# EAGLE schematic Spuds-V0.6 (EAGLE 6.4)
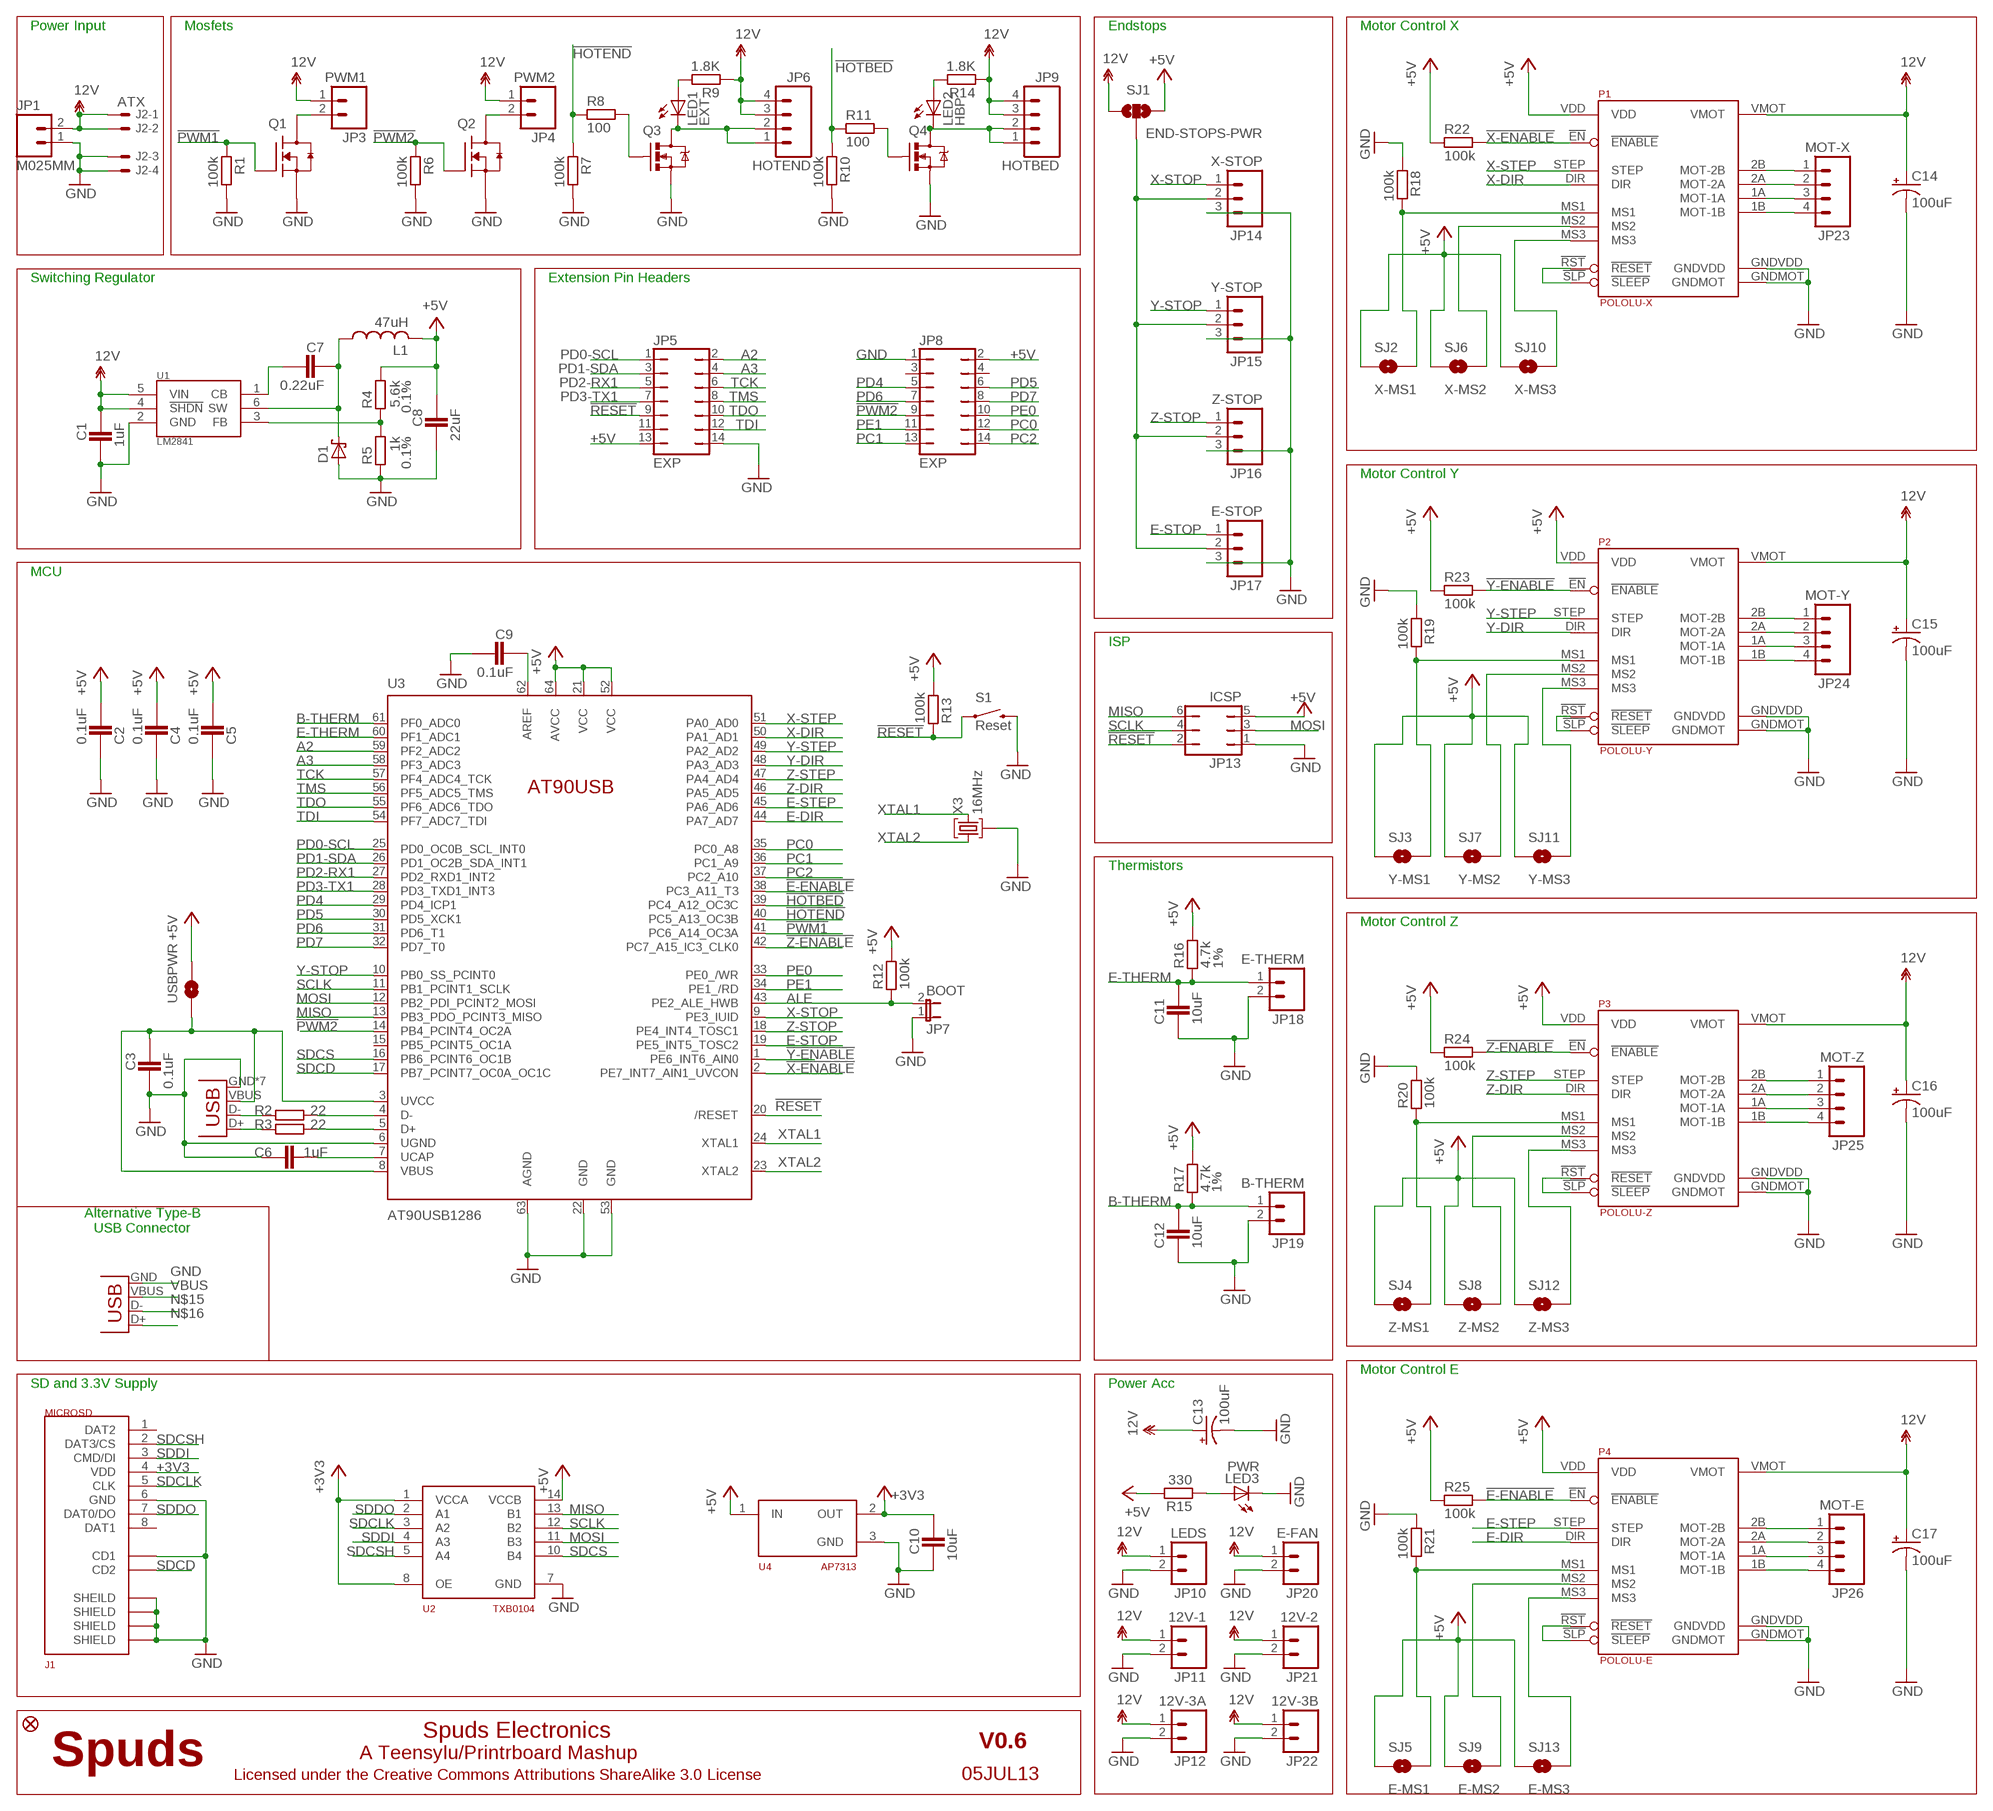
[diagram p0: schematic, sheet 1]

## Parts
C1  1uF  CAPACITOR_0805  [CAPC2012X145AN]
C2  0.1uF  CAPACITOR_0805  [CAPC2012X145AN]
C3  0.1uF  CAPACITOR_0805  [CAPC2012X145AN]
C4  0.1uF  CAPACITOR_0805  [CAPC2012X145AN]
C5  0.1uF  CAPACITOR_0805  [CAPC2012X145AN]
C6  1uF  CAPACITOR_0805  [CAPC2012X145AN]
C7  0.22uF  CAPACITOR_0805  [CAPC2012X145AN]
C8  22uF  CAPACITOR_0805  [CAPC2012X145AN]
C9  0.1uF  CAPACITOR_0805  [CAPC2012X145AN]
C10  10uF  CAPACITOR_0805  [CAPC2012X145AN]
C11  10uF  CAPACITOR_0805  [CAPC2012X145AN]
C12  10uF  CAPACITOR_0805  [CAPC2012X145AN]
C13  100uF  CPOL-USD  [PANASONIC_D]
C14  100uF  CPOL-USD  [PANASONIC_D]
C15  100uF  CPOL-USD  [PANASONIC_D]
C16  100uF  CPOL-USD  [PANASONIC_D]
C17  100uF  CPOL-USD  [PANASONIC_D]
D1  SCH-DIODESMA  [SMA]
J1  MICROSD  [AMPHENOL-MICROSD]
J2  ATX  5566-4  [5566-4]
JP1  M025MM  [SCREWTERMINAL-5MM-2]
JP2  FIDUCIAL1X2.5  [FIDUCIAL-1X2.5]
JP3  PWM1  M02PTH  [1X02]
JP4  PWM2  M02PTH  [1X02]
JP5  EXP  JP7Q  [JP7Q]
JP6  HOTEND  M04POLAR  [MOLEX-1X4]
JP7  BOOT  JUMPER-2PTH  [1X02]
JP8  EXP  JP7Q  [JP7Q]
JP9  HOTBED  M04POLAR  [MOLEX-1X4]
JP10  LEDS  M02PTH  [1X02]
JP11  12V-1  M02PTH  [1X02]
JP12  12V-3A  M02PTH  [1X02]
JP13  ICSP  JP3Q  [JP3Q]
JP14  X-STOP  M03POLAR  [MOLEX-1X3]
JP15  Y-STOP  M03POLAR  [MOLEX-1X3]
JP16  Z-STOP  M03POLAR  [MOLEX-1X3]
JP17  E-STOP  M03POLAR  [MOLEX-1X3]
JP18  E-THERM  M02PTH  [1X02]
JP19  B-THERM  M02PTH  [1X02]
JP20  E-FAN  M02PTH  [1X02]
JP21  12V-2  M02PTH  [1X02]
JP22  12V-3B  M02PTH  [1X02]
JP23  MOT-X  M04POLAR  [MOLEX-1X4]
JP24  MOT-Y  M04POLAR  [MOLEX-1X4]
JP25  MOT-Z  M04POLAR  [MOLEX-1X4]
JP26  MOT-E  M04POLAR  [MOLEX-1X4]
L1  47uH  L-US  [SDR1006]
LED1  EXT  LEDCHIP-LED0805  [CHIP-LED0805]
LED2  HBP  LEDCHIP-LED0805  [CHIP-LED0805]
LED3  PWR  LEDCHIP-LED0805  [CHIP-LED0805]
P1  POLOLU-X  POLOLU-ALLEGRO  [POLOLU-ALLEGRO-PTH]
P2  POLOLU-Y  POLOLU-ALLEGRO  [POLOLU-ALLEGRO-PTH]
P3  POLOLU-Z  POLOLU-ALLEGRO  [POLOLU-ALLEGRO-PTH]
P4  POLOLU-E  POLOLU-ALLEGRO  [POLOLU-ALLEGRO-PTH]
Q1  RFP30N06LE  MOSFET-NCH_SOT-23  [SOT95P280X135-3N]
Q2  RFP30N06LE  MOSFET-NCH_SOT-23  [SOT95P280X135-3N]
Q3  RFP30N06LE  MOSFET-NCHANNELPTH2  [TO220V]
Q4  RFP30N06LE  MOSFET-NCHANNELPTH2  [TO220V]
R1  100k  RESISTOR_0805  [RESC2012X70N]
R2  22  RESISTOR_0805  [RESC2012X70N]
R3  22  RESISTOR_0805  [RESC2012X70N]
R4  5.6k  RESISTOR_0805  [RESC2012X70N]
R5  1k  RESISTOR_0805  [RESC2012X70N]
R6  100k  RESISTOR_0805  [RESC2012X70N]
R7  100k  RESISTOR_0805  [RESC2012X70N]
R8  100  RESISTOR_0805  [RESC2012X70N]
R9  1.8K  RESISTOR_0805  [RESC2012X70N]
R10  100k  RESISTOR_0805  [RESC2012X70N]
R11  100  RESISTOR_0805  [RESC2012X70N]
R12  100k  RESISTOR_0805  [RESC2012X70N]
R13  100k  RESISTOR_0805  [RESC2012X70N]
R14  1.8K  RESISTOR_0805  [RESC2012X70N]
R15  330  RESISTOR_0805  [RESC2012X70N]
R16  4.7k  RESISTOR_0805  [RESC2012X70N]
R17  4.7k  RESISTOR_0805  [RESC2012X70N]
R18  100k  RESISTOR_0805  [RESC2012X70N]
R19  100k  RESISTOR_0805  [RESC2012X70N]
R20  100k  RESISTOR_0805  [RESC2012X70N]
R21  100k  RESISTOR_0805  [RESC2012X70N]
R22  100k  RESISTOR_0805  [RESC2012X70N]
R23  100k  RESISTOR_0805  [RESC2012X70N]
R24  100k  RESISTOR_0805  [RESC2012X70N]
R25  100k  RESISTOR_0805  [RESC2012X70N]
S1  Reset  SWITCH-MOMENTARY-2  [TACTILE_SWITCH_TALL]
SJ1  END-STOPS-PWR  SOLDERJUMPER_2WAYPASTE2&3  [SJ_3_PASTE2&3]
SJ2  X-MS1  SOLDERJUMPERNC  [SJ_2S]
SJ3  Y-MS1  SOLDERJUMPERNC  [SJ_2S]
SJ4  Z-MS1  SOLDERJUMPERNC  [SJ_2S]
SJ5  E-MS1  SOLDERJUMPERNC  [SJ_2S]
SJ6  X-MS2  SOLDERJUMPERNC  [SJ_2S]
SJ7  Y-MS2  SOLDERJUMPERNC  [SJ_2S]
SJ8  Z-MS2  SOLDERJUMPERNC  [SJ_2S]
SJ9  E-MS2  SOLDERJUMPERNC  [SJ_2S]
SJ10  X-MS3  SOLDERJUMPERNC  [SJ_2S]
SJ11  Y-MS3  SOLDERJUMPERNC  [SJ_2S]
SJ12  Z-MS3  SOLDERJUMPERNC  [SJ_2S]
SJ13  E-MS3  SOLDERJUMPERNC  [SJ_2S]
U1  LM2841  [TSOT6]
U2  TXB0104  [TSSOP14]
U3  AT90USB1286  AT90USB  [TQFP64-2]
U4  AP7313  [SOT23C]
USBPWR  SOLDERJUMPERNO  [SJ_2S-NO]
X1  USBPTH  [USB-B-PTH]
X2  USB-MICROB  [USB-MICROB]
X3  16MHz  AWSCR-CV  [AWSCR]

## Nets
12V [power]: C1.1 C13.+ C14.+ C15.+ C16.+ C17.+ J2.1 J2.2 JP1.2 JP3.1 JP4.1 JP6.3 JP6.4 JP9.3 JP9.4 JP10.1 JP11.1 JP12.1 JP20.1 JP21.1 JP22.1 P1.VMOT P2.VMOT P3.VMOT P4.VMOT R9.1 R14.1 SJ1.1 U1.4(!SHDN) U1.5(VIN)
!E-ENABLE: P4.!EN(!ENABLE) R25.2 U3.38(PC3_A11_T3)
!HOTBED: R10.1 R11.1 U3.39(PC4_A12_OC3C)
!HOTEND: R7.1 R8.1 U3.40(PC5_A13_OC3B)
!PWM1: Q1.1(G) R1.1 U3.41(PC6_A14_OC3A)
!PWM2: JP8.9 Q2.1(G) R6.1 U3.14(PB4_PCINT4_OC2A)
!RESET: JP5.9 JP13.2 R13.1 S1.A2 U3.20(/RESET)
!X-ENABLE: P1.!EN(!ENABLE) R22.2 U3.2(PE7_INT7_AIN1_UVCON)
!Y-ENABLE: P2.!EN(!ENABLE) R23.2 U3.1(PE6_INT6_AIN0)
!Z-ENABLE: P3.!EN(!ENABLE) R24.2 U3.42(PC7_A15_IC3_CLK0)
+3V3 [power]: C10.1 J1.4(VDD) U2.1(VCCA) U2.8(OE) U4.2(OUT)
+5V [power]: C2.2 C4.2 C5.2 C8.1 JP5.13 JP8.2 JP13.5 L1.P$2 P1.VDD P2.VDD P3.VDD P4.VDD R4.1 R12.2 R13.2 R15.2 R16.2 R17.2 R22.1 R23.1 R24.1 R25.1 SJ1.3 SJ2.1 SJ3.1 SJ4.1 SJ5.1 SJ6.1 SJ7.1 SJ8.1 SJ9.1 SJ10.1 SJ11.1 SJ12.1 SJ13.1 U2.14(VCCB) U3.21(VCC) U3.52(VCC) U3.64(AVCC) U4.1(IN) USBPWR.2
A2: JP5.2 U3.59(PF2_ADC2)
A3: JP5.4 U3.58(PF3_ADC3)
ALE: JP7.2 R12.1 U3.43(PE2_ALE_HWB)
AREF: C9.1 U3.62(AREF)
B-THERM: C12.2 JP19.1 R17.1 U3.61(PF0_ADC0)
E-DIR: P4.DIR U3.44(PA7_AD7)
E-MS1: P4.MS1 R21.2 SJ5.2
E-MS2: P4.MS2 SJ9.2
E-MS3: P4.MS3 SJ13.2
E-RESETSLEEP: P4.!RST(!RESET) P4.!SLP(!SLEEP)
E-STEP: P4.STEP U3.45(PA6_AD6)
E-STOP: JP17.1 U3.19(PE5_INT5_TOSC2)
E-THERM: C11.2 JP18.1 R16.1 U3.60(PF1_ADC1)
END-STOP-PWR [power]: JP14.2 JP15.2 JP16.2 JP17.2 SJ1.2
GND [power]: C1.2 C2.1 C3.2 C4.1 C5.1 C6.1 C8.2 C9.2 C10.2 C11.1 C12.1 C13.- C14.- C15.- C16.- C17.- D1.A J1.6(GND) J1.C1(SHEILD) J1.C2(SHIELD) J1.C3(SHIELD) J1.C4(SHIELD) J1.CD1 J2.3 J2.4 JP1.1 JP5.14 JP7.1 JP8.1 JP10.2 JP11.2 JP12.2 JP13.1 JP14.3 JP15.3 JP16.3 JP17.3 JP18.2 JP19.2 JP20.2 JP21.2 JP22.2 LED3.C P1.GNDMOT P1.GNDVDD P2.GNDMOT P2.GNDVDD P3.GNDMOT P3.GNDVDD P4.GNDMOT P4.GNDVDD Q1.2(S) Q2.2(S) Q3.3(S) Q4.3(S) R1.2 R5.2 R6.2 R7.2 R10.2 R18.1 R19.1 R20.2 R21.1 S1.B2 U1.2(GND) U2.7(GND) U3.6(UGND) U3.22(GND) U3.53(GND) U3.63(AGND) U4.3(GND) X1.GND X2.GND X2.MT1(GND) X2.MT2(GND) X2.MT3(GND) X2.MT4(GND) X2.MT5(GND) X2.MT6(GND) X3.GND
HOTBED-GND [power]: JP9.1 JP9.2 LED2.C Q4.2(D)
HOTEND-GND [power]: JP6.1 JP6.2 LED1.C Q3.2(D)
MISO: JP13.6 U2.13(B1) U3.13(PB3_PDO_PCINT3_MISO)
MOSI: JP13.3 U2.11(B3) U3.12(PB2_PDI_PCINT2_MOSI)
N$1: LED3.A R15.1
N$2: LED1.A R9.2
N$3: R2.2 U3.4(D-)
N$4: R3.2 U3.5(D+)
N$5: LED2.A R14.2
N$6: JP3.2 Q1.3(D)
N$7: Q4.1(G) R11.2
N$8: JP24.2 P2.2A(MOT-2A)
N$9: C6.2 U3.7(UCAP)
N$10: JP23.1 P1.2B(MOT-2B)
N$11: JP23.2 P1.2A(MOT-2A)
N$12: JP23.3 P1.1A(MOT-1A)
N$13: JP23.4 P1.1B(MOT-1B)
N$14: JP4.2 Q2.3(D)
N$15: R2.1 X1.D- X2.D-
N$16: R3.1 X1.D+ X2.D+
N$22: R4.2 R5.1 U1.3(FB)
N$24: JP24.3 P2.1A(MOT-1A)
N$25: JP24.4 P2.1B(MOT-1B)
N$26: JP24.1 P2.2B(MOT-2B)
N$54: JP26.1 P4.2B(MOT-2B)
N$55: JP26.2 P4.2A(MOT-2A)
N$56: JP26.3 P4.1A(MOT-1A)
N$59: JP26.4 P4.1B(MOT-1B)
N$71: Q3.1(G) R8.2
N$75: C7.1 D1.C L1.P$1 U1.6(SW)
N$77: C7.2 U1.1(CB)
PC0: JP8.12 U3.35(PC0_A8)
PC1: JP8.13 U3.36(PC1_A9)
PC2: JP8.14 U3.37(PC2_A10)
PD0-SCL: JP5.1 U3.25(PD0_OC0B_SCL_INT0)
PD1-SDA: JP5.3 U3.26(PD1_OC2B_SDA_INT1)
PD2-RX1: JP5.5 U3.27(PD2_RXD1_INT2)
PD3-TX1: JP5.7 U3.28(PD3_TXD1_INT3)
PD4: JP8.5 U3.29(PD4_ICP1)
PD5: JP8.6 U3.30(PD5_XCK1)
PD6: JP8.7 U3.31(PD6_T1)
PD7: JP8.8 U3.32(PD7_T0)
PE0: JP8.10 U3.33(PE0_/WR)
PE1: JP8.11 U3.34(PE1_/RD)
SCLK: JP13.4 U2.12(B2) U3.11(PB1_PCINT1_SCLK)
SDCD: J1.CD2 U3.17(PB7_PCINT7_OC0A_OC1C)
SDCLK: J1.5(CLK) U2.3(A2)
SDCS: U2.10(B4) U3.16(PB6_PCINT6_OC1B)
SDCSH: J1.2(DAT3/CS) U2.5(A4)
SDDI: J1.3(CMD/DI) U2.4(A3)
SDDO: J1.7(DAT0/DO) U2.2(A1)
TCK: JP5.6 U3.57(PF4_ADC4_TCK)
TDI: JP5.12 U3.54(PF7_ADC7_TDI)
TDO: JP5.10 U3.55(PF6_ADC6_TDO)
TMS: JP5.8 U3.56(PF5_ADC5_TMS)
VBUS: C3.1 U3.3(UVCC) U3.8(VBUS) USBPWR.1 X1.VBUS X2.VBUS
X-DIR: P1.DIR U3.50(PA1_AD1)
X-MS1: P1.MS1 R18.2 SJ2.2
X-MS2: P1.MS2 SJ6.2
X-MS3: P1.MS3 SJ10.2
X-RESETSLEEP: P1.!RST(!RESET) P1.!SLP(!SLEEP)
X-STEP: P1.STEP U3.51(PA0_AD0)
X-STOP: JP14.1 U3.9(PE3_IUID)
XTAL1: U3.24(XTAL1) X3.IN
XTAL2: U3.23(XTAL2) X3.OUT
Y-DIR: P2.DIR U3.48(PA3_AD3)
Y-MS1: P2.MS1 R19.2 SJ3.2
Y-MS2: P2.MS2 SJ7.2
Y-MS3: P2.MS3 SJ11.2
Y-RESETSLEEP: P2.!RST(!RESET) P2.!SLP(!SLEEP)
Y-STEP: P2.STEP U3.49(PA2_AD2)
Y-STOP: JP15.1 U3.10(PB0_SS_PCINT0)
Z-DIR: P3.DIR U3.46(PA5_AD5)
Z-MOT-1A [power]: JP25.3 P3.1A(MOT-1A)
Z-MOT-1B [power]: JP25.4 P3.1B(MOT-1B)
Z-MOT-2A [power]: JP25.2 P3.2A(MOT-2A)
Z-MOT-2B [power]: JP25.1 P3.2B(MOT-2B)
Z-MS1: P3.MS1 R20.1 SJ4.2
Z-MS2: P3.MS2 SJ8.2
Z-MS3: P3.MS3 SJ12.2
Z-RESETSLEEP: P3.!RST(!RESET) P3.!SLP(!SLEEP)
Z-STEP: P3.STEP U3.47(PA4_AD4)
Z-STOP: JP16.1 U3.18(PE4_INT4_TOSC1)
Unconnected: J1.1(DAT2) J1.8(DAT1) JP5.11 JP8.3 JP8.4 U3.15(PB5_PCINT5_OC1A)

## Notes on the sheet
- Power Input | Mosfets | Endstops | Motor Control X
- Switching Regulator | Extension Pin Headers
- Motor Control Y
- MCU
- ISP
- Thermistors
- Motor Control Z
- Alternative Type-B
  USB Connector
- Motor Control E
- SD and 3.3V Supply | Power Acc
- Spuds Electronics
- V0.6
- A Teensylu/Printrboard Mashup
- Spuds
- Licensed under the Creative Commons Attributions ShareAlike 3.0 License | 05JUL13

## Library data of the parts
C1 C6 = ipc-7351-capacitor:CAPACITOR_; PARTNO: 587-2229-1-ND
C2-C5 C9 = ipc-7351-capacitor:CAPACITOR_; PARTNO: 311-1361-1-ND
C7 = ipc-7351-capacitor:CAPACITOR_; PARTNO: 399-3491-1-ND
C8 = ipc-7351-capacitor:CAPACITOR_; PARTNO: 587-1305-1-ND
C10-C12 = ipc-7351-capacitor:CAPACITOR_; PARTNO: 311-1355-1-ND
C13-C17 = rcl:CPOL-US: POLARIZED CAPACITOR, American symbol; PARTNO: PCE3951CT-ND
D1 = printrbot:SCH-DIODE: Schottky Diodes Source: Fairchild .. BAT54.pdf; PARTNO: B140-FDICT-ND
J1 = printrbot:MICROSD; PARTNO: ED2983-ND
J2 = printrbot:5566-4: Mini FIT connector 4 pol Source: http://www.molex.com; OC_FARNELL: unknown; OC_NEWARK: unknown; PARTNO: WM3801-ND
JP1 = SparkFun-Connectors:M02: Standard 2-pin 0.1" header. Use with - straight break away headers ( PRT-00116) - right angle break away headers (PRT-00553) - swiss pins (PRT-00743) - machine pins (PRT-00117) - female headers (PRT-00115) Molex polarized connector foot print use with: PRT-08233 with associated crimp pins and housings. 2.54_SCREWTERM for use with PRT-10571. 3.5mm Screw Terminal footprints for PRT-08084 5mm Screw Terminal footprints for use with PRT-08433; PARTNO: A98355-ND
JP2 = SparkFun:FIDUCIAL: Fiducial Alignment Points Various fiducial points for machine vision alignment.; PARTNO: *
JP3 JP4 JP10 = SparkFun:M02: Header 2 Standard 2-pin 0.1" header. Use with straight break away headers (SKU : PRT-00116), right angle break away headers (PRT-00553), swiss pins (PRT-00743), machine pins (PRT-00117), and female headers (PRT-00115). Molex polarized connector foot print use with SKU : PRT-08233 with associated crimp pins and housings.; PARTNO: WM4000-ND
JP5 JP8 = printrbot:JP7Q: JUMPER; PARTNO: 609-3491-ND
JP6 JP9 JP23-JP26 = SparkFun:M04: Header 4 Standard 4-pin 0.1" header. Use with straight break away headers (SKU : PRT-00116), right angle break away headers (PRT-00553), swiss pins (PRT-00743), machine pins (PRT-00117), and female headers (PRT-00115). Molex polarized connector foot print use with SKU : PRT-08231 with associated crimp pins and housings.; PARTNO: WM4113-ND
JP7 = SparkFun:JUMPER-2: Jumper Basic 0.1" spaced jumper. Use with breakaway headers.; PARTNO: WM4000-ND
JP11 JP12 JP18-JP22 = SparkFun:M02: Header 2 Standard 2-pin 0.1" header. Use with straight break away headers (SKU : PRT-00116), right angle break away headers (PRT-00553), swiss pins (PRT-00743), machine pins (PRT-00117), and female headers (PRT-00115). Molex polarized connector foot print use with SKU : PRT-08233 with associated crimp pins and housings.; PARTNO: WM4111-ND
JP13 = printrbot:JP3Q: JUMPER; PARTNO: 609-3210-ND
JP14-JP17 = SparkFun:M03: Header 3 Standard 3-pin 0.1" header. Use with straight break away headers (SKU : PRT-00116), right angle break away headers (PRT-00553), swiss pins (PRT-00743), machine pins (PRT-00117), and female headers (PRT-00115). Molex polarized connector foot print use with SKU : PRT-08232 with associated crimp pins and housings.; PARTNO: WM4112-ND
L1 = printrbot:L-US; PARTNO: SDR1006-470KLCT-ND
LED1 = led:LED: LED OSRAM: - CHIPLED LG R971, LG N971, LY N971, LG Q971, LY Q971, LO R971, LY R971 LH N974, LH R974 LS Q976, LO Q976, LY Q976 LO Q996 - Hyper CHIPLED LW Q18S LB Q993, LB Q99A, LB R99A - SideLED LS A670, LO A670, LY A670, LG A670, LP A670 LB A673, LV A673, LT A673, LW A673 LH A674 LY A675 LS A676, LA A676, LO A676, LY A676, LW A676 LS A679, LY A679, LG A679 - Hyper Micro SIDELED® LS Y876, LA Y876, LO Y876, LY Y876 LT Y87S - SmartLED LW L88C, LW L88S LB L89C, LB L89S, LG L890 LS L89K, LO L89K, LY L89K LS L896, LA L896, LO L896, LY L896 - TOPLED LS T670, LO T670, LY T670, LG T670, LP T670 LSG T670, LSP T670, LSY T670, LOP T670, LYG T670 LG T671, LOG T671, LSG T671 LB T673, LV T673, LT T673, LW T673 LH T674 LS T676, LA T676, LO T676, LY T676, LB T676, LH T676, LSB T676, LW T676 LB T67C, LV T67C, LT T67C, LS T67K, LO T67K, LY T67K, LW E67C LS E67B, LA E67B, LO E67B, LY E67B, LB E67C, LV E67C, LT E67C LW T67C LS T679, LY T679, LG T679 LS T770, LO T770, LY T770, LG T770, LP T770 LB T773, LV T773, LT T773, LW T773 LH T774 LS E675, LA E675, LY E675, LS T675 LS T776, LA T776, LO T776, LY T776, LB T776 LHGB T686 LT T68C, LB T68C - Hyper Mini TOPLED® LB M676 - Mini TOPLED Santana® LG M470 LS M47K, LO M47K, LY M47K Source: http://www.osram.convergy.de LUXEON: - LUMILED® LXK2-PW12-R00, LXK2-PW12-S00, LXK2-PW14-U00, LXK2-PW14-V00 LXK2-PM12-R00, LXK2-PM12-S00, LXK2-PM14-U00 LXK2-PE12-Q00, LXK2-PE12-R00, LXK2-PE12-S00, LXK2-PE14-T00, LXK2-PE14-U00 LXK2-PB12-K00, LXK2-PB12-L00, LXK2-PB12-M00, LXK2-PB14-N00, LXK2-PB14-P00, LXK2-PB14-Q00 LXK2-PR12-L00, LXK2-PR12-M00, LXK2-PR14-Q00, LXK2-PR14-R00 LXK2-PD12-Q00, LXK2-PD12-R00, LXK2-PD12-S00 LXK2-PH12-R00, LXK2-PH12-S00 LXK2-PL12-P00, LXK2-PL12-Q00, LXK2-PL12-R00 Source: www.luxeon.com KINGBRIGHT: KA-3528ASYC Source: www.kingbright.com; PARTNO: 754-1132-1-ND
LED2 = led:LED: LED OSRAM: - CHIPLED LG R971, LG N971, LY N971, LG Q971, LY Q971, LO R971, LY R971 LH N974, LH R974 LS Q976, LO Q976, LY Q976 LO Q996 - Hyper CHIPLED LW Q18S LB Q993, LB Q99A, LB R99A - SideLED LS A670, LO A670, LY A670, LG A670, LP A670 LB A673, LV A673, LT A673, LW A673 LH A674 LY A675 LS A676, LA A676, LO A676, LY A676, LW A676 LS A679, LY A679, LG A679 - Hyper Micro SIDELED® LS Y876, LA Y876, LO Y876, LY Y876 LT Y87S - SmartLED LW L88C, LW L88S LB L89C, LB L89S, LG L890 LS L89K, LO L89K, LY L89K LS L896, LA L896, LO L896, LY L896 - TOPLED LS T670, LO T670, LY T670, LG T670, LP T670 LSG T670, LSP T670, LSY T670, LOP T670, LYG T670 LG T671, LOG T671, LSG T671 LB T673, LV T673, LT T673, LW T673 LH T674 LS T676, LA T676, LO T676, LY T676, LB T676, LH T676, LSB T676, LW T676 LB T67C, LV T67C, LT T67C, LS T67K, LO T67K, LY T67K, LW E67C LS E67B, LA E67B, LO E67B, LY E67B, LB E67C, LV E67C, LT E67C LW T67C LS T679, LY T679, LG T679 LS T770, LO T770, LY T770, LG T770, LP T770 LB T773, LV T773, LT T773, LW T773 LH T774 LS E675, LA E675, LY E675, LS T675 LS T776, LA T776, LO T776, LY T776, LB T776 LHGB T686 LT T68C, LB T68C - Hyper Mini TOPLED® LB M676 - Mini TOPLED Santana® LG M470 LS M47K, LO M47K, LY M47K Source: http://www.osram.convergy.de LUXEON: - LUMILED® LXK2-PW12-R00, LXK2-PW12-S00, LXK2-PW14-U00, LXK2-PW14-V00 LXK2-PM12-R00, LXK2-PM12-S00, LXK2-PM14-U00 LXK2-PE12-Q00, LXK2-PE12-R00, LXK2-PE12-S00, LXK2-PE14-T00, LXK2-PE14-U00 LXK2-PB12-K00, LXK2-PB12-L00, LXK2-PB12-M00, LXK2-PB14-N00, LXK2-PB14-P00, LXK2-PB14-Q00 LXK2-PR12-L00, LXK2-PR12-M00, LXK2-PR14-Q00, LXK2-PR14-R00 LXK2-PD12-Q00, LXK2-PD12-R00, LXK2-PD12-S00 LXK2-PH12-R00, LXK2-PH12-S00 LXK2-PL12-P00, LXK2-PL12-Q00, LXK2-PL12-R00 Source: www.luxeon.com KINGBRIGHT: KA-3528ASYC Source: www.kingbright.com; PARTNO: 754-1437-1-ND
LED3 = led:LED: LED OSRAM: - CHIPLED LG R971, LG N971, LY N971, LG Q971, LY Q971, LO R971, LY R971 LH N974, LH R974 LS Q976, LO Q976, LY Q976 LO Q996 - Hyper CHIPLED LW Q18S LB Q993, LB Q99A, LB R99A - SideLED LS A670, LO A670, LY A670, LG A670, LP A670 LB A673, LV A673, LT A673, LW A673 LH A674 LY A675 LS A676, LA A676, LO A676, LY A676, LW A676 LS A679, LY A679, LG A679 - Hyper Micro SIDELED® LS Y876, LA Y876, LO Y876, LY Y876 LT Y87S - SmartLED LW L88C, LW L88S LB L89C, LB L89S, LG L890 LS L89K, LO L89K, LY L89K LS L896, LA L896, LO L896, LY L896 - TOPLED LS T670, LO T670, LY T670, LG T670, LP T670 LSG T670, LSP T670, LSY T670, LOP T670, LYG T670 LG T671, LOG T671, LSG T671 LB T673, LV T673, LT T673, LW T673 LH T674 LS T676, LA T676, LO T676, LY T676, LB T676, LH T676, LSB T676, LW T676 LB T67C, LV T67C, LT T67C, LS T67K, LO T67K, LY T67K, LW E67C LS E67B, LA E67B, LO E67B, LY E67B, LB E67C, LV E67C, LT E67C LW T67C LS T679, LY T679, LG T679 LS T770, LO T770, LY T770, LG T770, LP T770 LB T773, LV T773, LT T773, LW T773 LH T774 LS E675, LA E675, LY E675, LS T675 LS T776, LA T776, LO T776, LY T776, LB T776 LHGB T686 LT T68C, LB T68C - Hyper Mini TOPLED® LB M676 - Mini TOPLED Santana® LG M470 LS M47K, LO M47K, LY M47K Source: http://www.osram.convergy.de LUXEON: - LUMILED® LXK2-PW12-R00, LXK2-PW12-S00, LXK2-PW14-U00, LXK2-PW14-V00 LXK2-PM12-R00, LXK2-PM12-S00, LXK2-PM14-U00 LXK2-PE12-Q00, LXK2-PE12-R00, LXK2-PE12-S00, LXK2-PE14-T00, LXK2-PE14-U00 LXK2-PB12-K00, LXK2-PB12-L00, LXK2-PB12-M00, LXK2-PB14-N00, LXK2-PB14-P00, LXK2-PB14-Q00 LXK2-PR12-L00, LXK2-PR12-M00, LXK2-PR14-Q00, LXK2-PR14-R00 LXK2-PD12-Q00, LXK2-PD12-R00, LXK2-PD12-S00 LXK2-PH12-R00, LXK2-PH12-S00 LXK2-PL12-P00, LXK2-PL12-Q00, LXK2-PL12-R00 Source: www.luxeon.com KINGBRIGHT: KA-3528ASYC Source: www.kingbright.com; PARTNO: 754-1131-1-ND
P1-P4 = pololu-allegro:POLOLU-ALLEGRO; PARTNO: 952-1823-ND
Q1 Q2 = ipc-7351-transistor:MOSFET-NCH_; PARTNO: IRLML2060TRPBFCT-ND
Q3 Q4 = SparkFun:MOSFET-NCHANNEL; PARTNO: IRLB8743PBF-ND
R1 R6 R7 R10 R12 R13 R18-R25 = ipc-7351-resistor:RESISTOR_; PARTNO: RMCF0805JT100KCT-ND
R2 R3 = ipc-7351-resistor:RESISTOR_; PARTNO: 311-22ARCT-ND
R4 = ipc-7351-resistor:RESISTOR_; PARTNO: P5.6KDATR-ND; TOLERANCE: 0.1%
R5 = ipc-7351-resistor:RESISTOR_; PARTNO: RG20P1.0KBCT-ND; TOLERANCE: 0.1%
R8 R11 = ipc-7351-resistor:RESISTOR_; PARTNO: 311-100ARCT-ND
R9 R14 = ipc-7351-resistor:RESISTOR_; PARTNO: 311-1.8LHCT-ND
R15 = ipc-7351-resistor:RESISTOR_; PARTNO: 311-330ARCT-ND
R16 R17 = ipc-7351-resistor:RESISTOR_; PARTNO: 311-4.70KCRCT-ND; TOLERANCE: 1%
S1 = printrbot:SWITCH-MOMENTARY-2; PARTNO: 450-1133-ND
SJ1 = SparkFun-Passives:SOLDERJUMPER_2WAY: Solder Jumper 2 way solder jumper; PARTNO: *
SJ2-SJ13 = SparkFun-Passives:SOLDERJUMPER: Solder Jumper Standard SMD solder jumper. Used to automate production. Two varients : Normally Open and Normally Closed are the same, but have different paste layers. NC will have a large amount of paste and should jumper during reflow.; PARTNO: *
U1 = printrbot:LM2841; PARTNO: LM2841XMK-ADJLCT-ND
U2 = printrbot:TXB0104; PARTNO: 296-21929-1-ND
U3 = Atmel-at90usb-teensy:AT90USB; PARTNO: AT90USB1286-AURCT-ND
U4 = printrbot:AP7313; PARTNO: AP7313-33SAG-7DICT-ND
USBPWR = SparkFun:SOLDERJUMPER: Solder Jumper Standard SMD solder jumper. Used to automate production. Two varients : Normally Open and Normally Closed are the same, but have different paste layers. NC will have a large amount of paste and should jumper during reflow.; PARTNO: *
X1 = SparkFun-Connectors:USB: USB Connectors USB-B-PTH is fully proven SKU : PRT-00139/CONN-08278 USB-miniB is fully proven SKU : PRT-00587 USB-A-PCB is untested. USB-A-H is throughly reviewed, but untested. Spark Fun Electronics SKU : PRT-00437 USB-B-SMT is throughly reviewed, but untested. Needs silkscreen touching up. USB-A-S has not been used/tested USB-MB-H has not been used/tested USB-MICROB has been used. CONN-09505; PARTNO: ED2983-ND; PROD_ID: CONN-08278; VALUE: USB-B
X2 = printrbot:USB: USB Connectors USB-B-PTH is fully proven SKU : PRT-00139 USB-miniB is fully proven SKU : PRT-00587 USB-A-PCB is untested. USB-A-H is throughly reviewed, but untested. Spark Fun Electronics SKU : PRT-00437 USB-B-SMT is throughly reviewed, but untested. Needs silkscreen touching up. USB-A-S has not been used/tested USB-MB-H has not been used/tested; PARTNO: 455-2562-1-ND
X3 = printrbot:AWSCR-CV; PARTNO: 535-10011-1-ND